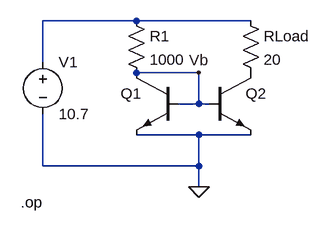
[diagram p0: schematic bjt-mirror.asc]
bjt-mirror.asc, the LTspice schematic file:
Version 4
SHEET 1 880 680
WIRE -64 -144 -208 -144
WIRE 112 -144 -64 -144
WIRE -208 -80 -208 -144
WIRE 32 -64 -64 -64
WIRE 32 -16 32 -64
WIRE 32 -16 0 -16
WIRE 48 -16 32 -16
WIRE 32 32 -64 32
WIRE 112 32 32 32
WIRE -208 80 -208 0
WIRE 32 80 32 32
WIRE 32 80 -208 80
WIRE 32 112 32 80
FLAG 32 112 0
FLAG 32 -64 Vb
SYMBOL res -80 -160 R0
SYMATTR InstName R1
SYMATTR Value 1000
SYMBOL res 96 -160 R0
SYMATTR InstName RLoad
SYMATTR Value 20
SYMBOL voltage -208 -96 R0
WINDOW 123 0 0 Left 2
WINDOW 39 0 0 Left 2
SYMATTR InstName V1
SYMATTR Value 10.7
SYMBOL npn 0 -64 M0
WINDOW 3 56 68 Invisible 2
SYMATTR InstName Q1
SYMATTR Value 2N2222
SYMBOL npn 48 -64 R0
WINDOW 3 56 68 Invisible 2
SYMATTR InstName Q2
SYMATTR Value 2N2222
TEXT -242 136 Left 2 !.op

The netlist it stands for:
* bjt-mirror.asc
R1 N001 Vb 1000
RLoad N001 P001 20
V1 N001 0 10.7
Q1 Vb Vb 0 0 2N2222
Q2 P001 Vb 0 0 2N2222
.model NPN NPN
.model PNP PNP
.lib standard.bjt
.op
.backanno
.end